# EAGLE schematic Eagle_LEDCUBE (EAGLE 6.5.0)
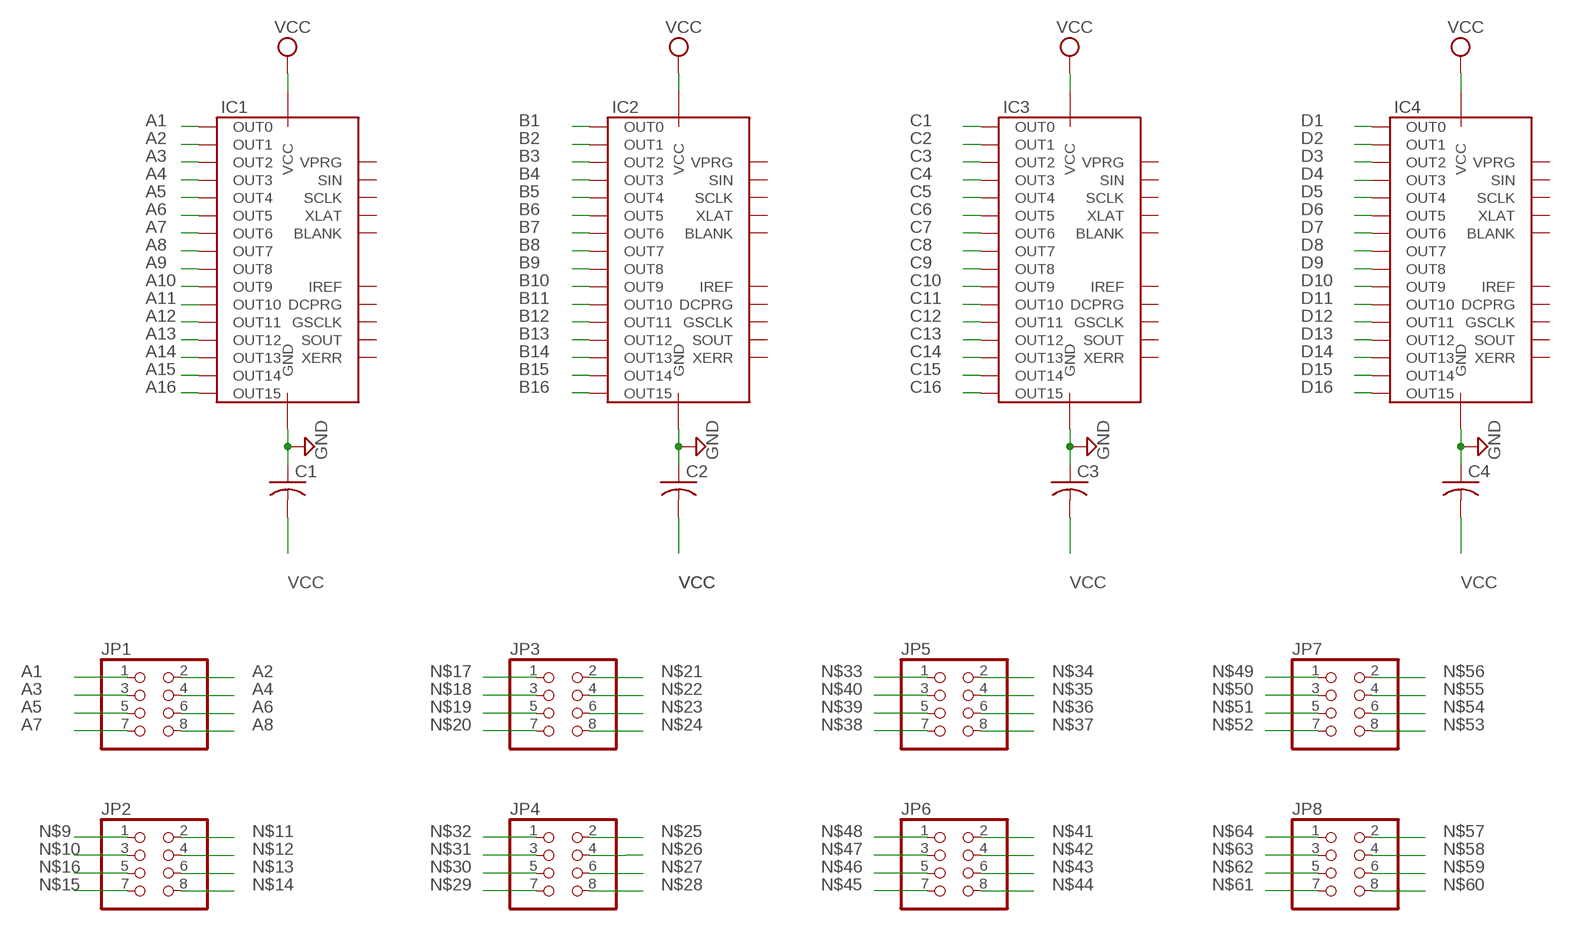
[diagram p0: schematic, sheet 1]

## Parts
C1  C-USC0805K  [C0805K]
C2  C-USC0805K  [C0805K]
C3  C-USC0805K  [C0805K]
C4  C-USC0805K  [C0805K]
IC1  IC-PACKAGE_DIL28-1  [IC-SSOP28]
IC2  IC-PACKAGE_DIL28-1  [IC-SSOP28]
IC3  IC-PACKAGE_DIL28-1  [IC-SSOP28]
IC4  IC-PACKAGE_DIL28-1  [IC-SSOP28]
JP1  PINHD-2X4  [2X04]
JP2  PINHD-2X4  [2X04]
JP3  PINHD-2X4  [2X04]
JP4  PINHD-2X4  [2X04]
JP5  PINHD-2X4  [2X04]
JP6  PINHD-2X4  [2X04]
JP7  PINHD-2X4  [2X04]
JP8  PINHD-2X4  [2X04]

## Nets
A1: IC1.7(OUT0) JP1.1
A2: IC1.8(OUT1) JP1.2
A3: IC1.9(OUT2) JP1.3
A4: IC1.10(OUT3) JP1.4
A5: IC1.11(OUT4) JP1.5
A6: IC1.12(OUT5) JP1.6
A7: IC1.13(OUT6) JP1.7
A8: IC1.14(OUT7) JP1.8
A9: IC1.15(OUT8)
A10: IC1.16(OUT9)
A11: IC1.17(OUT10)
A12: IC1.18(OUT11)
A13: IC1.19(OUT12)
A14: IC1.20(OUT13)
A15: IC1.21(OUT14)
A16: IC1.22(OUT15)
B1: IC2.7(OUT0)
B2: IC2.8(OUT1)
B3: IC2.9(OUT2)
B4: IC2.10(OUT3)
B5: IC2.11(OUT4)
B6: IC2.12(OUT5)
B7: IC2.13(OUT6)
B8: IC2.14(OUT7)
B9: IC2.15(OUT8)
B10: IC2.16(OUT9)
B11: IC2.17(OUT10)
B12: IC2.18(OUT11)
B13: IC2.19(OUT12)
B14: IC2.20(OUT13)
B15: IC2.21(OUT14)
B16: IC2.22(OUT15)
C1: IC3.7(OUT0)
C2: IC3.8(OUT1)
C3: IC3.9(OUT2)
C4: IC3.10(OUT3)
C5: IC3.11(OUT4)
C6: IC3.12(OUT5)
C7: IC3.13(OUT6)
C8: IC3.14(OUT7)
C9: IC3.15(OUT8)
C10: IC3.16(OUT9)
C11: IC3.17(OUT10)
C12: IC3.18(OUT11)
C13: IC3.19(OUT12)
C14: IC3.20(OUT13)
C15: IC3.21(OUT14)
C16: IC3.22(OUT15)
D1: IC4.7(OUT0)
D2: IC4.8(OUT1)
D3: IC4.9(OUT2)
D4: IC4.10(OUT3)
D5: IC4.11(OUT4)
D6: IC4.12(OUT5)
D7: IC4.13(OUT6)
D8: IC4.14(OUT7)
D9: IC4.15(OUT8)
D10: IC4.16(OUT9)
D11: IC4.17(OUT10)
D12: IC4.18(OUT11)
D13: IC4.19(OUT12)
D14: IC4.20(OUT13)
D15: IC4.21(OUT14)
D16: IC4.22(OUT15)
GND: C1.1 C2.1 C3.1 C4.1 IC1.1(GND) IC2.1(GND) IC3.1(GND) IC4.1(GND)
N$9: JP2.1
N$10: JP2.3
N$11: JP2.2
N$12: JP2.4
N$13: JP2.6
N$14: JP2.8
N$15: JP2.7
N$16: JP2.5
N$17: JP3.1
N$18: JP3.3
N$19: JP3.5
N$20: JP3.7
N$21: JP3.2
N$22: JP3.4
N$23: JP3.6
N$24: JP3.8
N$25: JP4.2
N$26: JP4.4
N$27: JP4.6
N$28: JP4.8
N$29: JP4.7
N$30: JP4.5
N$31: JP4.3
N$32: JP4.1
N$33: JP5.1
N$34: JP5.2
N$35: JP5.4
N$36: JP5.6
N$37: JP5.8
N$38: JP5.7
N$39: JP5.5
N$40: JP5.3
N$41: JP6.2
N$42: JP6.4
N$43: JP6.6
N$44: JP6.8
N$45: JP6.7
N$46: JP6.5
N$47: JP6.3
N$48: JP6.1
N$49: JP7.1
N$50: JP7.3
N$51: JP7.5
N$52: JP7.7
N$53: JP7.8
N$54: JP7.6
N$55: JP7.4
N$56: JP7.2
N$57: JP8.2
N$58: JP8.4
N$59: JP8.6
N$60: JP8.8
N$61: JP8.7
N$62: JP8.5
N$63: JP8.3
N$64: JP8.1
VCC: C1.2 C2.2 C3.2 C4.2 IC1.28(VCC) IC2.28(VCC) IC3.28(VCC) IC4.28(VCC)
Unconnected: IC1.2(BLANK) IC1.3(XLAT) IC1.4(SCLK) IC1.5(SIN) IC1.6(VPRG) IC1.23(XERR) IC1.24(SOUT) IC1.25(GSCLK) IC1.26(DCPRG) IC1.27(IREF) IC2.2(BLANK) IC2.3(XLAT) IC2.4(SCLK) IC2.5(SIN) IC2.6(VPRG) IC2.23(XERR) IC2.24(SOUT) IC2.25(GSCLK) IC2.26(DCPRG) IC2.27(IREF) IC3.2(BLANK) IC3.3(XLAT) IC3.4(SCLK) IC3.5(SIN) IC3.6(VPRG) IC3.23(XERR) IC3.24(SOUT) IC3.25(GSCLK) IC3.26(DCPRG) IC3.27(IREF) IC4.2(BLANK) IC4.3(XLAT) IC4.4(SCLK) IC4.5(SIN) IC4.6(VPRG) IC4.23(XERR) IC4.24(SOUT) IC4.25(GSCLK) IC4.26(DCPRG) IC4.27(IREF)

## Library data of the parts
C1-C4 = resistor:C-US: CAPACITOR, American symbol
IC1-IC4 = TLC5940:IC-PACKAGE_DIL28: Dual In Line
JP1-JP8 = pinhead:PINHD-2X4: PIN HEADER